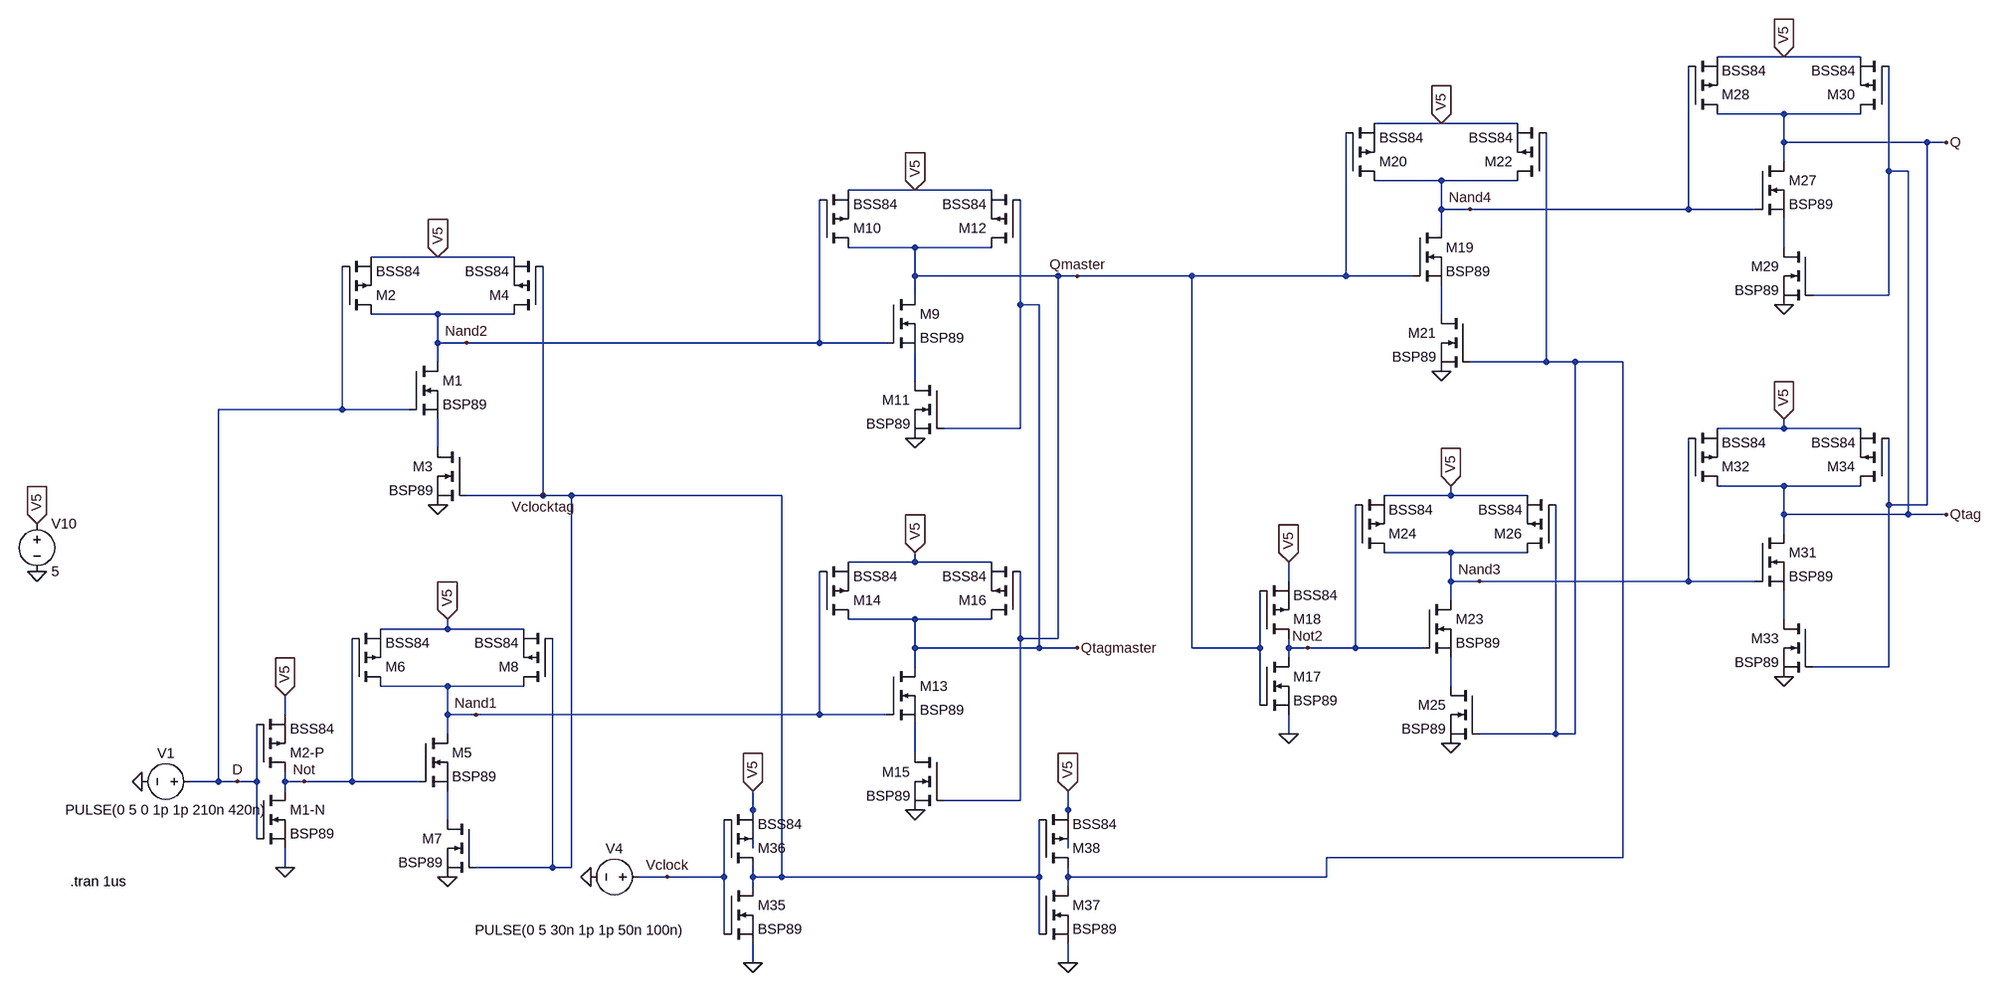
[diagram p0: schematic D-FlipFlop_Simulation.asc]
D-FlipFlop_Simulation.asc, the LTspice schematic file:
Version 4.1
SHEET 1 2984 1220
WIRE 2640 -352 2528 -352
WIRE 2768 -352 2640 -352
WIRE 2640 -256 2528 -256
WIRE 2768 -256 2640 -256
WIRE 2064 -240 1952 -240
WIRE 2192 -240 2064 -240
WIRE 2640 -208 2640 -256
WIRE 2880 -208 2640 -208
WIRE 2912 -208 2880 -208
WIRE 2640 -176 2640 -208
WIRE 2816 -160 2816 -336
WIRE 2848 -160 2816 -160
WIRE 2064 -144 1952 -144
WIRE 2192 -144 2064 -144
WIRE 1152 -128 1040 -128
WIRE 1280 -128 1152 -128
WIRE 2064 -96 2064 -144
WIRE 2112 -96 2064 -96
WIRE 2480 -96 2480 -336
WIRE 2480 -96 2112 -96
WIRE 2592 -96 2480 -96
WIRE 2064 -64 2064 -96
WIRE 1152 -32 1040 -32
WIRE 1280 -32 1152 -32
WIRE 2640 -32 2640 -80
WIRE 352 -16 240 -16
WIRE 480 -16 352 -16
WIRE 1152 16 1152 -32
WIRE 1392 16 1152 16
WIRE 1424 16 1392 16
WIRE 1616 16 1424 16
WIRE 1904 16 1904 -224
WIRE 1904 16 1616 16
WIRE 2016 16 1904 16
WIRE 1152 48 1152 16
WIRE 2816 48 2816 -160
WIRE 2816 48 2688 48
WIRE 1328 64 1328 -112
WIRE 1360 64 1328 64
WIRE 352 80 240 80
WIRE 480 80 352 80
WIRE 2064 80 2064 32
WIRE 352 128 352 80
WIRE 400 128 352 128
WIRE 992 128 992 -112
WIRE 992 128 400 128
WIRE 1104 128 992 128
WIRE 352 160 352 128
WIRE 2240 160 2240 -224
WIRE 2240 160 2112 160
WIRE 2288 160 2240 160
WIRE 2368 160 2288 160
WIRE 1152 192 1152 144
WIRE 192 240 192 0
WIRE 192 240 -16 240
WIRE 304 240 192 240
WIRE 1328 272 1328 64
WIRE 1328 272 1200 272
WIRE 2640 272 2640 256
WIRE 2640 272 2528 272
WIRE 2768 272 2640 272
WIRE 352 304 352 256
WIRE 2640 368 2528 368
WIRE 2768 368 2640 368
WIRE 528 384 528 0
WIRE 528 384 400 384
WIRE 576 384 528 384
WIRE 928 384 576 384
WIRE 2080 384 2080 368
WIRE 2080 384 1968 384
WIRE 2208 384 2080 384
WIRE 2816 400 2816 288
WIRE 2880 400 2880 -208
WIRE 2880 400 2816 400
WIRE 2640 416 2640 368
WIRE 2848 416 2848 -160
WIRE 2848 416 2640 416
WIRE 2912 416 2848 416
WIRE 2640 448 2640 416
WIRE 2080 480 1968 480
WIRE 2208 480 2080 480
WIRE 1152 496 1152 480
WIRE 1152 496 1040 496
WIRE 1280 496 1152 496
WIRE 1808 528 1808 496
WIRE 2080 528 2080 480
WIRE 2128 528 2080 528
WIRE 2480 528 2480 288
WIRE 2480 528 2128 528
WIRE 2592 528 2480 528
WIRE 2080 560 2080 528
WIRE 1152 592 1040 592
WIRE 1280 592 1152 592
WIRE 2640 592 2640 544
WIRE 368 608 368 592
WIRE 368 608 256 608
WIRE 496 608 368 608
WIRE 1328 624 1328 512
WIRE 1392 624 1392 16
WIRE 1392 624 1328 624
WIRE 1152 640 1152 592
WIRE 1360 640 1360 64
WIRE 1360 640 1152 640
WIRE 1424 640 1360 640
WIRE 1616 640 1616 16
WIRE 1760 640 1760 544
WIRE 1760 640 1616 640
WIRE 1808 640 1808 624
WIRE 1840 640 1808 640
WIRE 1920 640 1920 400
WIRE 1920 640 1840 640
WIRE 2032 640 1920 640
WIRE 1808 656 1808 640
WIRE 1152 672 1152 640
WIRE 2816 672 2816 400
WIRE 2816 672 2688 672
WIRE 368 704 256 704
WIRE 496 704 368 704
WIRE 2080 704 2080 656
WIRE 1760 736 1760 640
WIRE 96 752 96 720
WIRE 368 752 368 704
WIRE 416 752 368 752
WIRE 992 752 992 512
WIRE 992 752 416 752
WIRE 1104 752 992 752
WIRE 368 784 368 752
WIRE 1808 784 1808 752
WIRE 2256 784 2256 400
WIRE 2256 784 2128 784
WIRE 2288 784 2288 160
WIRE 2288 784 2256 784
WIRE 1152 816 1152 768
WIRE -16 864 -16 240
WIRE -16 864 -64 864
WIRE 16 864 -16 864
WIRE 48 864 48 768
WIRE 48 864 16 864
WIRE 96 864 96 848
WIRE 128 864 96 864
WIRE 208 864 208 624
WIRE 208 864 128 864
WIRE 320 864 208 864
WIRE 96 880 96 864
WIRE 1328 896 1328 624
WIRE 1328 896 1200 896
WIRE 880 912 880 880
WIRE 1408 912 1408 880
WIRE 368 928 368 880
WIRE 48 960 48 864
WIRE 880 976 880 912
WIRE 1408 976 1408 912
WIRE 2368 992 2368 160
WIRE 2368 992 1872 992
WIRE 96 1008 96 976
WIRE 544 1008 544 624
WIRE 544 1008 416 1008
WIRE 576 1008 576 384
WIRE 576 1008 544 1008
WIRE 736 1024 688 1024
WIRE 832 1024 832 928
WIRE 832 1024 736 1024
WIRE 880 1024 880 1008
WIRE 928 1024 928 384
WIRE 928 1024 880 1024
WIRE 1360 1024 1360 928
WIRE 1360 1024 928 1024
WIRE 1408 1024 1408 1008
WIRE 1872 1024 1872 992
WIRE 1872 1024 1408 1024
WIRE 880 1040 880 1024
WIRE 1408 1040 1408 1024
WIRE 832 1120 832 1024
WIRE 1360 1120 1360 1024
WIRE 880 1168 880 1136
WIRE 1408 1168 1408 1136
FLAG 96 1008 0
FLAG -144 864 0
FLAG 608 1024 0
FLAG 352 400 0
FLAG 368 1024 0
FLAG 1152 288 0
FLAG 1152 912 0
FLAG 1424 16 Qmaster
FLAG 1424 640 Qtagmaster
FLAG 528 384 Vclocktag
FLAG 128 864 Not
FLAG 416 752 Nand1
FLAG 400 128 Nand2
FLAG 16 864 D
FLAG 1808 784 0
FLAG 2064 176 0
FLAG 2080 800 0
FLAG 2640 64 0
FLAG 2640 688 0
FLAG 2912 -208 Q
FLAG 2912 416 Qtag
FLAG 1840 640 Not2
FLAG 2128 528 Nand3
FLAG 2112 -96 Nand4
FLAG 880 1168 0
FLAG 736 1024 Vclock
FLAG -320 512 0
FLAG -320 432 V5
IOPIN -320 432 In
FLAG 352 -16 V5
IOPIN 352 -16 In
FLAG 1152 -128 V5
IOPIN 1152 -128 In
FLAG 2064 -240 V5
IOPIN 2064 -240 In
FLAG 2640 -352 V5
IOPIN 2640 -352 In
FLAG 2080 368 V5
IOPIN 2080 368 In
FLAG 2640 256 V5
IOPIN 2640 256 In
FLAG 1152 480 V5
IOPIN 1152 480 In
FLAG 1808 496 V5
IOPIN 1808 496 In
FLAG 880 880 V5
IOPIN 880 880 In
FLAG 368 592 V5
IOPIN 368 592 In
FLAG 96 720 V5
IOPIN 96 720 In
FLAG 1408 1168 0
FLAG 1408 880 V5
IOPIN 1408 880 In
SYMBOL nmos 48 880 R0
SYMATTR InstName M1-N
SYMATTR Value BSP89
SYMBOL pmos 48 848 M180
SYMATTR InstName M2-P
SYMATTR Value BSS84
SYMBOL voltage -48 864 R90
WINDOW 0 -32 56 VBottom 2
WINDOW 3 32 56 VTop 2
WINDOW 123 0 0 Left 0
WINDOW 39 0 0 Left 0
SYMATTR InstName V1
SYMATTR Value PULSE(0 5 0 1p 1p 210n 420n)
SYMBOL nmos 304 160 R0
SYMATTR InstName M1
SYMATTR Value BSP89
SYMBOL pmos 192 80 M180
SYMATTR InstName M2
SYMATTR Value BSS84
SYMBOL nmos 400 304 M0
SYMATTR InstName M3
SYMATTR Value BSP89
SYMBOL pmos 528 80 R180
SYMATTR InstName M4
SYMATTR Value BSS84
SYMBOL voltage 704 1024 M270
WINDOW 0 32 56 VTop 2
WINDOW 3 -74 114 VBottom 2
WINDOW 123 0 0 Left 0
WINDOW 39 0 0 Left 0
SYMATTR InstName V4
SYMATTR Value PULSE(0 5 30n 1p 1p 50n 100n)
SYMBOL nmos 320 784 R0
SYMATTR InstName M5
SYMATTR Value BSP89
SYMBOL pmos 208 704 M180
SYMATTR InstName M6
SYMATTR Value BSS84
SYMBOL nmos 416 928 M0
SYMATTR InstName M7
SYMATTR Value BSP89
SYMBOL pmos 544 704 R180
SYMATTR InstName M8
SYMATTR Value BSS84
SYMBOL nmos 1104 48 R0
SYMATTR InstName M9
SYMATTR Value BSP89
SYMBOL pmos 992 -32 M180
SYMATTR InstName M10
SYMATTR Value BSS84
SYMBOL nmos 1200 192 M0
SYMATTR InstName M11
SYMATTR Value BSP89
SYMBOL pmos 1328 -32 R180
SYMATTR InstName M12
SYMATTR Value BSS84
SYMBOL nmos 1104 672 R0
SYMATTR InstName M13
SYMATTR Value BSP89
SYMBOL pmos 992 592 M180
SYMATTR InstName M14
SYMATTR Value BSS84
SYMBOL nmos 1200 816 M0
SYMATTR InstName M15
SYMATTR Value BSP89
SYMBOL pmos 1328 592 R180
SYMATTR InstName M16
SYMATTR Value BSS84
SYMBOL nmos 1760 656 R0
SYMATTR InstName M17
SYMATTR Value BSP89
SYMBOL pmos 1760 624 M180
SYMATTR InstName M18
SYMATTR Value BSS84
SYMBOL nmos 2016 -64 R0
SYMATTR InstName M19
SYMATTR Value BSP89
SYMBOL pmos 1904 -144 M180
SYMATTR InstName M20
SYMATTR Value BSS84
SYMBOL nmos 2112 80 M0
SYMATTR InstName M21
SYMATTR Value BSP89
SYMBOL pmos 2240 -144 R180
SYMATTR InstName M22
SYMATTR Value BSS84
SYMBOL nmos 2032 560 R0
SYMATTR InstName M23
SYMATTR Value BSP89
SYMBOL pmos 1920 480 M180
SYMATTR InstName M24
SYMATTR Value BSS84
SYMBOL nmos 2128 704 M0
SYMATTR InstName M25
SYMATTR Value BSP89
SYMBOL pmos 2256 480 R180
SYMATTR InstName M26
SYMATTR Value BSS84
SYMBOL nmos 2592 -176 R0
SYMATTR InstName M27
SYMATTR Value BSP89
SYMBOL pmos 2480 -256 M180
SYMATTR InstName M28
SYMATTR Value BSS84
SYMBOL nmos 2688 -32 M0
SYMATTR InstName M29
SYMATTR Value BSP89
SYMBOL pmos 2816 -256 R180
SYMATTR InstName M30
SYMATTR Value BSS84
SYMBOL nmos 2592 448 R0
SYMATTR InstName M31
SYMATTR Value BSP89
SYMBOL pmos 2480 368 M180
SYMATTR InstName M32
SYMATTR Value BSS84
SYMBOL nmos 2688 592 M0
SYMATTR InstName M33
SYMATTR Value BSP89
SYMBOL pmos 2816 368 R180
SYMATTR InstName M34
SYMATTR Value BSS84
SYMBOL nmos 832 1040 R0
SYMATTR InstName M35
SYMATTR Value BSP89
SYMBOL pmos 832 1008 M180
SYMATTR InstName M36
SYMATTR Value BSS84
SYMBOL voltage -320 416 R0
WINDOW 123 0 0 Left 0
WINDOW 39 0 0 Left 0
SYMATTR InstName V10
SYMATTR Value 5
SYMBOL nmos 1360 1040 R0
SYMATTR InstName M37
SYMATTR Value BSP89
SYMBOL pmos 1360 1008 M180
SYMATTR InstName M38
SYMATTR Value BSS84
TEXT -264 1032 Left 2 !.tran 1us

The netlist it stands for:
* D-FlipFlop_Simulation.asc
M1-N Not D 0 0 BSP89
M2-P Not D V5 V5 BSS84
V1 D 0 PULSE(0 5 0 1p 1p 210n 420n)
M1 Nand2 D N005 N005 BSP89
M2 Nand2 D V5 V5 BSS84
M3 N005 Vclocktag 0 0 BSP89
M4 Nand2 Vclocktag V5 V5 BSS84
V4 Vclock 0 PULSE(0 5 30n 1p 1p 50n 100n)
M5 Nand1 Not N009 N009 BSP89
M6 Nand1 Not V5 V5 BSS84
M7 N009 Vclocktag 0 0 BSP89
M8 Nand1 Vclocktag V5 V5 BSS84
M9 Qmaster Nand2 N004 N004 BSP89
M10 Qmaster Nand2 V5 V5 BSS84
M11 N004 Qtagmaster 0 0 BSP89
M12 Qmaster Qtagmaster V5 V5 BSS84
M13 Qtagmaster Nand1 N008 N008 BSP89
M14 Qtagmaster Nand1 V5 V5 BSS84
M15 N008 Qmaster 0 0 BSP89
M16 Qtagmaster Qmaster V5 V5 BSS84
M17 Not2 Qmaster 0 0 BSP89
M18 Not2 Qmaster V5 V5 BSS84
M19 Nand4 Qmaster N002 N002 BSP89
M20 Nand4 Qmaster V5 V5 BSS84
M21 N002 N003 0 0 BSP89
M22 Nand4 N003 V5 V5 BSS84
M23 Nand3 Not2 N007 N007 BSP89
M24 Nand3 Not2 V5 V5 BSS84
M25 N007 N003 0 0 BSP89
M26 Nand3 N003 V5 V5 BSS84
M27 Q Nand4 N001 N001 BSP89
M28 Q Nand4 V5 V5 BSS84
M29 N001 Qtag 0 0 BSP89
M30 Q Qtag V5 V5 BSS84
M31 Qtag Nand3 N006 N006 BSP89
M32 Qtag Nand3 V5 V5 BSS84
M33 N006 Q 0 0 BSP89
M34 Qtag Q V5 V5 BSS84
M35 Vclocktag Vclock 0 0 BSP89
M36 Vclocktag Vclock V5 V5 BSS84
V10 V5 0 5
M37 N003 Vclocktag 0 0 BSP89
M38 N003 Vclocktag V5 V5 BSS84
.model NMOS NMOS
.model PMOS PMOS
.lib standard.mos
.tran 1us
.backanno
.end